# EAGLE design max1811smd (EAGLE 6.1)
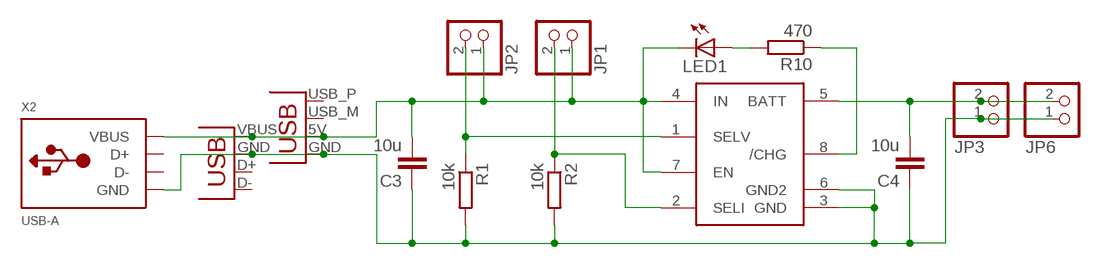
[diagram p0: schematic, sheet 1]

## Parts
C3  10u  C-EUC0805K  [C0805K]
C4  10u  C-EUC0805K  [C0805K]
CN1  USBPCB  [USB-A-PCB]
JP1  PINHD-1X2  [1X02]
JP2  PINHD-1X2  [1X02]
JP3  PINHD-1X2  [1X02]
JP6  PINHD-1X2  [1X02]
LED1  LEDCHIPLED_0805  [CHIPLED_0805]
R1  10k  R-EU_M0805  [M0805]
R2  10k  R-EU_M0805  [M0805]
R10  470  R-EU_M0805  [M0805]
U$1  MAX1811SO8  [SO08]
X1  USB-A-H  [USB-A-H]
X2  USB-A  [MOLEX_480371000]

## Nets
N$1: C3.1 C4.1 CN1.GND JP3.1 JP6.1 R1.2 R2.2 U$1.3(GND) U$1.6(GND2) X1.GND(VBUS) X2.4(GND)
N$3: JP1.2 R2.1 U$1.2(SELI)
N$4: JP2.2 R1.1 U$1.1(SELV)
N$5: R10.1 U$1.8(/CHG)
N$6: LED1.A R10.2
N$8: C4.2 JP3.2 JP6.2 U$1.5(BATT)
N$9: C3.2 CN1.5V(VBUS) JP1.1 JP2.1 LED1.C U$1.4(IN) U$1.7(EN) X1.VBUS(GND) X2.1(VBUS)
Unconnected: CN1.USB_M(D-) CN1.USB_P(D+) X1.D+(D-) X1.D-(D+) X2.2(D-) X2.3(D+)

## Library data of the parts
C3 C4 = rcl:C-EU: CAPACITOR, European symbol
CN1 X1 = SparkFun:USB: USB Connectors USB-B-PTH is fully proven SKU : PRT-00139 USB-miniB is fully proven SKU : PRT-00587 USB-A-PCB is untested. USB-A-H is throughly reviewed, but untested. Spark Fun Electronics SKU : PRT-00437 USB-B-SMT is throughly reviewed, but untested. Needs silkscreen touching up. USB-A-S has not been used/tested USB-MB-H has not been used/tested
JP1-JP3 JP6 = pinhead:PINHD-1X2: PIN HEADER
LED1 = led:LED: LED OSRAM: - CHIPLED LG R971, LG N971, LY N971, LG Q971, LY Q971, LO R971, LY R971 LH N974, LH R974 LS Q976, LO Q976, LY Q976 LO Q996 - Hyper CHIPLED LW Q18S LB Q993, LB Q99A, LB R99A - SideLED LS A670, LO A670, LY A670, LG A670, LP A670 LB A673, LV A673, LT A673, LW A673 LH A674 LY A675 LS A676, LA A676, LO A676, LY A676, LW A676 LS A679, LY A679, LG A679 - Hyper Micro SIDELED® LS Y876, LA Y876, LO Y876, LY Y876 LT Y87S - SmartLED LW L88C, LW L88S LB L89C, LB L89S, LG L890 LS L89K, LO L89K, LY L89K LS L896, LA L896, LO L896, LY L896 - TOPLED LS T670, LO T670, LY T670, LG T670, LP T670 LSG T670, LSP T670, LSY T670, LOP T670, LYG T670 LG T671, LOG T671, LSG T671 LB T673, LV T673, LT T673, LW T673 LH T674 LS T676, LA T676, LO T676, LY T676, LB T676, LH T676, LSB T676, LW T676 LB T67C, LV T67C, LT T67C, LS T67K, LO T67K, LY T67K, LW E67C LS E67B, LA E67B, LO E67B, LY E67B, LB E67C, LV E67C, LT E67C LW T67C LS T679, LY T679, LG T679 LS T770, LO T770, LY T770, LG T770, LP T770 LB T773, LV T773, LT T773, LW T773 LH T774 LS E675, LA E675, LY E675, LS T675 LS T776, LA T776, LO T776, LY T776, LB T776 LHGB T686 LT T68C, LB T68C - Hyper Mini TOPLED® LB M676 - Mini TOPLED Santana® LG M470 LS M47K, LO M47K, LY M47K Source: http://www.osram.convergy.de LUXEON: - LUMILED® LXK2-PW12-R00, LXK2-PW12-S00, LXK2-PW14-U00, LXK2-PW14-V00 LXK2-PM12-R00, LXK2-PM12-S00, LXK2-PM14-U00 LXK2-PE12-Q00, LXK2-PE12-R00, LXK2-PE12-S00, LXK2-PE14-T00, LXK2-PE14-U00 LXK2-PB12-K00, LXK2-PB12-L00, LXK2-PB12-M00, LXK2-PB14-N00, LXK2-PB14-P00, LXK2-PB14-Q00 LXK2-PR12-L00, LXK2-PR12-M00, LXK2-PR14-Q00, LXK2-PR14-R00 LXK2-PD12-Q00, LXK2-PD12-R00, LXK2-PD12-S00 LXK2-PH12-R00, LXK2-PH12-S00 LXK2-PL12-P00, LXK2-PL12-Q00, LXK2-PL12-R00 Source: www.luxeon.com KINGBRIGHT: KA-3528ASYC Source: www.kingbright.com
R1 R2 R10 = rcl:R-EU_: RESISTOR, European symbol
U$1 = adafruit:MAX1811: Maxim MAX1811 USB li-ion battery charger http://www.ladyada.net/library/eagle
X2 = adafruit_t10:USB-A: USB type A 'plug' Used for things that can directly connect to a USB port, say USB key

## Board
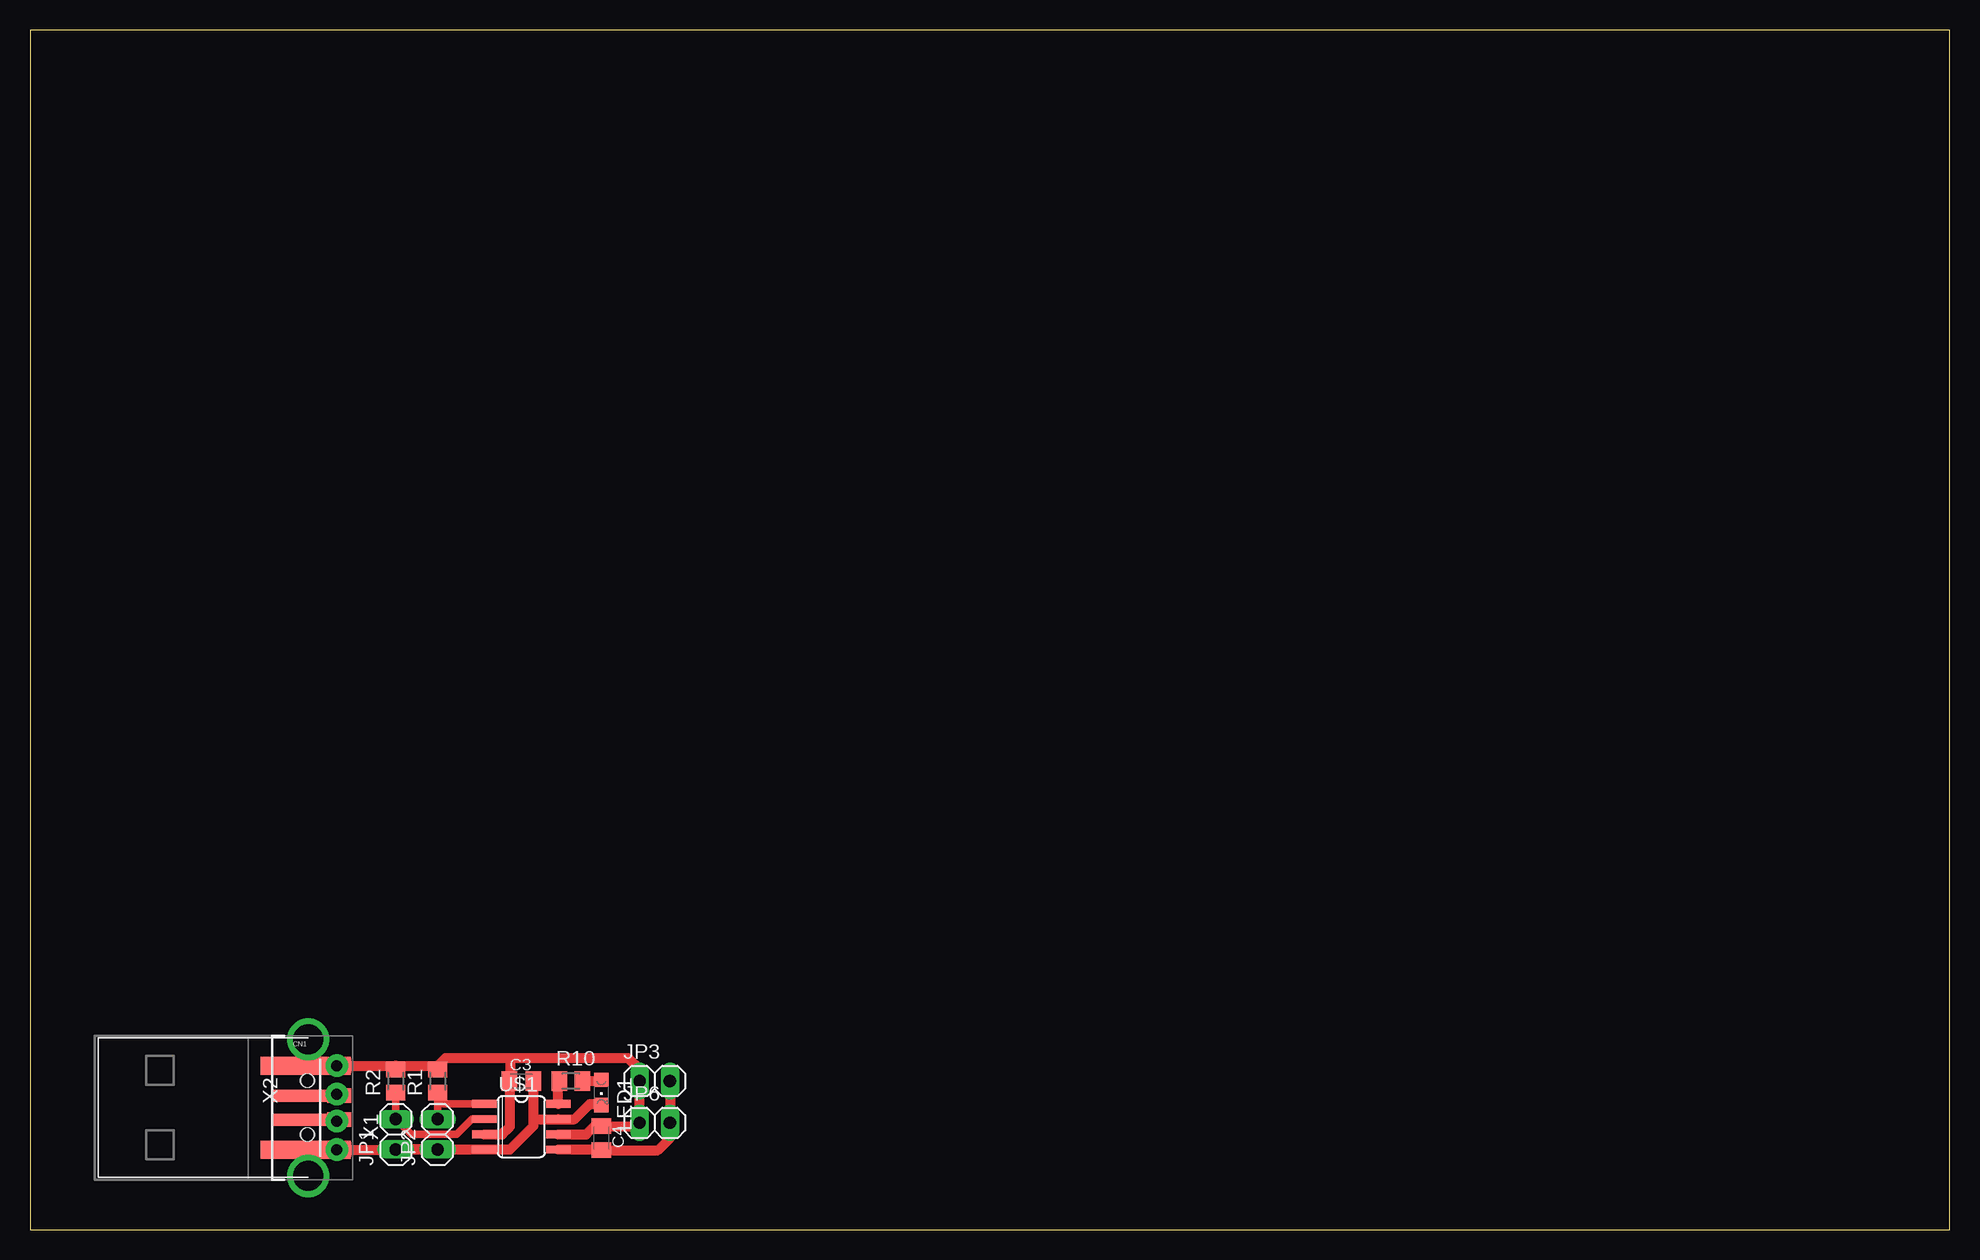
[diagram p1: board, top side]

Size 160 x 100 mm. Coordinates in mm from the lower left corner, seen from the top.
Outline: 0,0 160,0 160,100 0,100 0,0
Copper layers (1*16): Top 0.035mm / dielectric 1.5mm / Bottom 0.035mm
Design rules: minimum track width 10mil, minimum drill 24mil, track to track 8mil, track to pad 8mil, pad to pad 8mil, via to via 8mil, smd to smd 8mil, copper to edge 40mil, drill to drill 8mil, minimum pad ring 10mil, minimum via ring 8mil, stop-mask expansion 4mil, vias tented up to drill 0mil, thermal gap 10mil

### Footprints (pad centres in the part's own frame; a part is rotated, then mirrored left to right if it is on the bottom)
C0805K = smd 1.3 x 1.6: 1 -1,0; 2 1,0
USB-A-PCB = smd 7.5 x 1.5: 5V -0.2,-3.5; GND -0.2,3.5 | smd 6.5 x 1: USB_M 0.3,-1; USB_P 0.3,1
1X02 = drill 1.016 long: 1 -1.27,0; 2 1.27,0
CHIPLED_0805 = smd 1.2 x 1.2: A 0,-1.05; C 0,1.05
M0805 = smd 1.3 x 1.6: 1 -0.95,0; 2 0.95,0
SO08 = smd 0.66 x 2.032: 1 -1.905,-3.073; 2 -0.635,-3.073; 3 0.635,-3.073; 4 1.905,-3.073; 5 1.905,3.073; 6 0.635,3.073; 7 -0.635,3.073; 8 -1.905,3.073
USB-A-H = drill 0.914 pad 1.88: D+ 2.4,1.127; D- 2.4,-1.127; GND 2.4,3.5; VBUS 2.4,-3.5 | drill 2.2: GND2 0,-5.8; GND3 0,5.8 | hole 1.1: -0.1,2.25; -0.1,-2.25
MOLEX_480371000 = smd 1.2 x 2: 1 3.5,2.6; 2 1,2.6; 3 -1,2.6; 4 -3.5,2.6 | drill 2.5: M1 -5.7,0; M2 5.7,0 | hole 1.1: -2.25,0; 2.25,0

### Placement (x,y rotation side)
C3  40.96,12.38 0 top
C4  47.62,7.62 270 top
CN1  23.18,10.16 0 top
JP1  30.48,7.94 90 top
JP2  33.97,7.94 90 top
JP3  52.07,12.38 0 top
JP6  52.07,8.89 0 top
LED1  47.62,11.43 180 top
R1  33.97,12.38 90 top
R2  30.48,12.38 90 top
R10  45.09,12.38 0 top
U$1  40.96,8.57 270 top
X1  23.18,10.16 0 top
X2  23.18,10.16 270 top

### Tracks (layer width: path | path; a pad name or v marks a point on that pad's centre or on a via)
N$1
  Top 0.813: CN1.GND X1.GND X2.4 30.48,13.66 30.48,13.65 | 30.48,13.65 33.97,13.65 | R2.2 30.48,13.65 | R1.2 33.97,13.65 | U$1.6 46.35,7.94 46.99,8.57 47.58,8.57 C4.1 50.53,8.62 JP6.1 JP3.1 50.8,13.34 49.85,14.29 40.01,14.29 | U$1.3 39.37,7.94 40.01,8.57 40.01,12.43 | 40.01,14.29 34.61,14.29 33.97,13.65 | 40.01,14.29 40.01,12.43 | 40.01,12.43 C3.1
N$3  (1 unrouted)
  Top 0.61: R2.1 JP1.2 31.75,7.94 35.56,7.94 36.83,9.21 U$1.2
N$4
  Top 0.61: U$1.1 37.15,10.48 33.97,10.48 R1.1 JP2.2
N$5
  Top 0.813: U$1.8 44.03,12.28 R10.1
N$6
  Top 0.813: R10.2 47.53,12.38 LED1.A
N$8
  Top 0.813: JP3.2 JP6.2 53.34,7.62 52.34,6.62 C4.2 47.58,6.67 U$1.5
N$9
  Top 0.813: CN1.5V X1.VBUS X2.1 JP1.1 JP2.1 | JP2.1 JP1.1 | JP2.1 U$1.4 40.01,6.67 41.96,8.62 41.96,9.21 | 41.96,9.21 U$1.7 45.4,9.21 46.67,10.48 47.62,10.48 LED1.C | C3.2 41.96,9.21